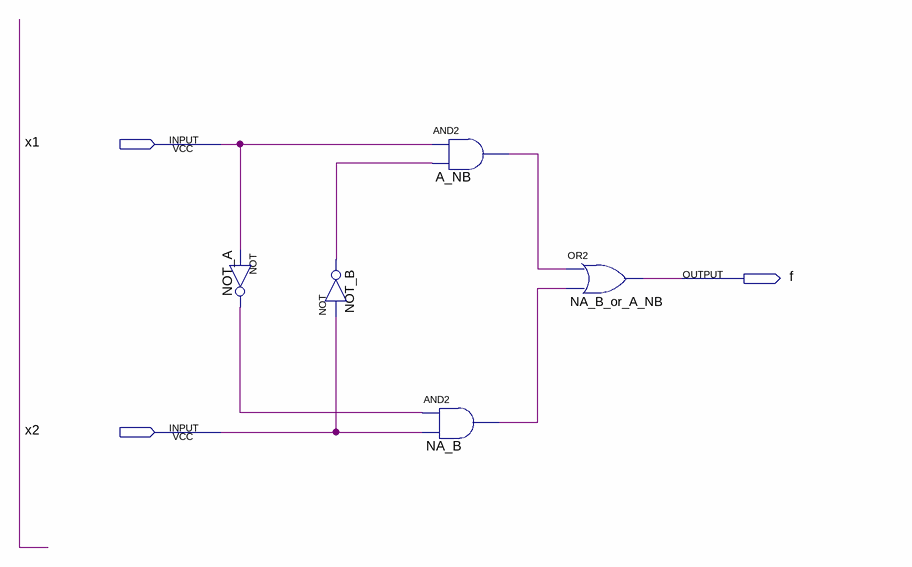
[diagram p0: schematic sheet]
// Quartus schematic xor_schematic.bdf as structural Verilog: 5 symbols, 3 pins
module xor_schematic (
  input  x1,
  input  x2,
  output f
);

  wire A_NB_out, NA_B_out, NOT_A_out, NOT_B_out;

  not NOT_A (NOT_A_out, x1);
  not NOT_B (NOT_B_out, x2);
  and A_NB (A_NB_out, x1, NOT_B_out);
  and NA_B (NA_B_out, NOT_A_out, x2);
  or NA_B_or_A_NB (f, A_NB_out, NA_B_out);
endmodule
